# EAGLE design 11Dof MPU6000 (EAGLE 6.2)
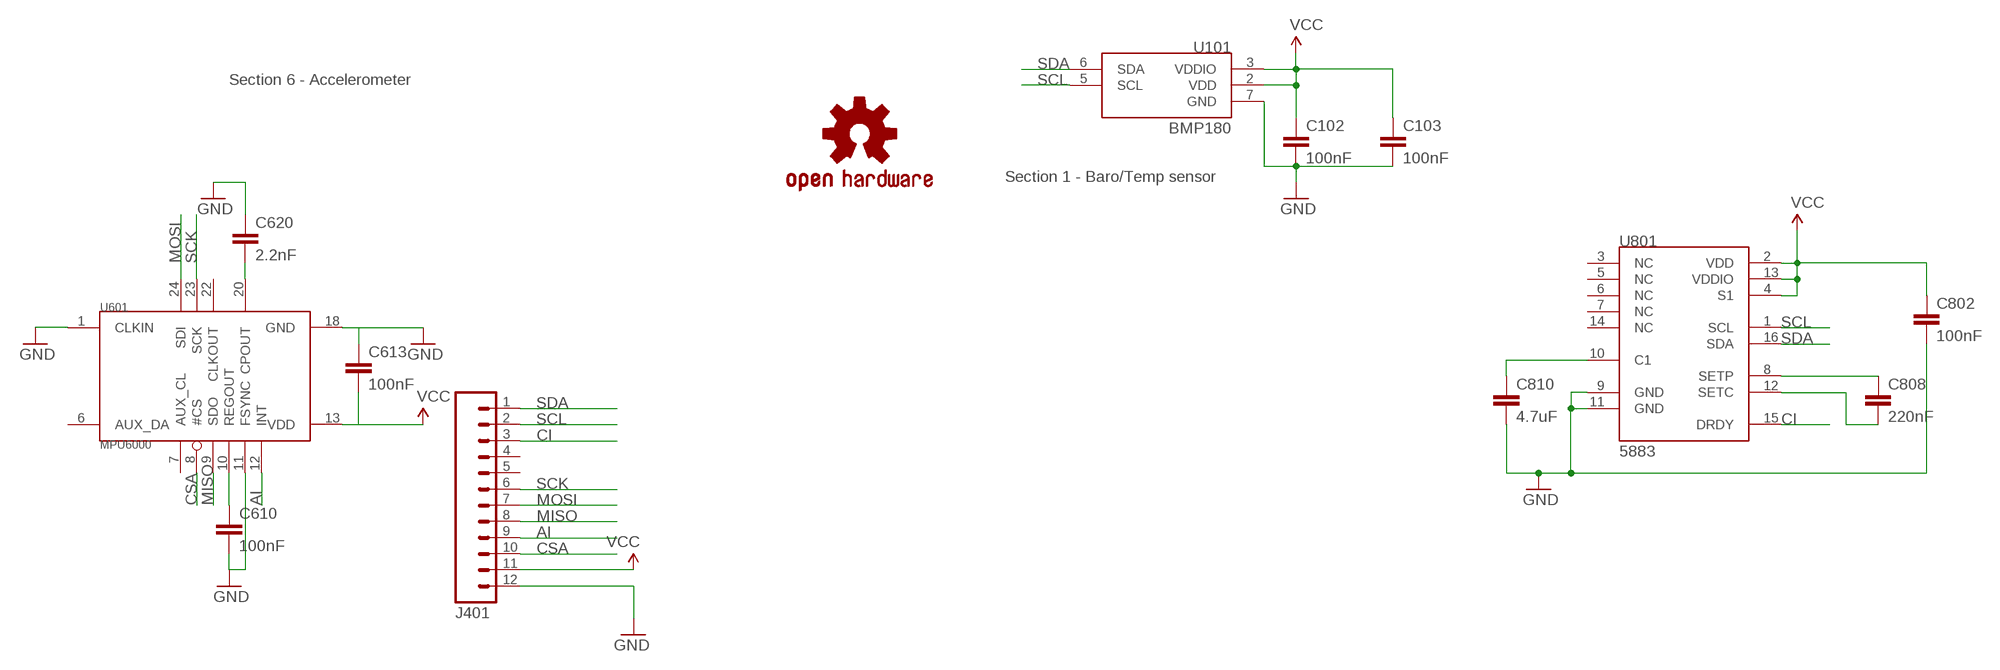
[diagram p0: schematic, sheet 1]

## Parts
C102  100nF  CAP0603-CAP  [0603-CAP]
C103  100nF  CAP0603-CAP  [0603-CAP]
C610  100nF  CAP0603-CAP  [0603-CAP]
C613  100nF  CAP0603-CAP  [0603-CAP]
C620  2.2nF  CAP0603-CAP  [0603-CAP]
C802  100nF  CAP0603-CAP  [0603-CAP]
C808  220nF  CAP0603-CAP  [0603-CAP]
C810  4.7uF  CAP0603-CAP  [0603-CAP]
J401  M12PTH  [1X12]
U101  BMP180  [BMP180]
U601  MPU6000  [MPU60X0]
U801  5883  HMC5883LSMD  [16LPCC]
U$2  OSHW-LOGOS  [OSHW-LOGO-S]

## Nets
AI: J401.9 U601.12(INT)
CI: J401.3 U801.15(DRDY)
CSA: J401.10 U601.8(#CS)
GND: C102.2 C103.2 C610.2 C613.1 C620.1 C802.2 C810.2 J401.12 U101.7(GND) U601.1(CLKIN) U601.11(FSYNC) U601.18(GND) U801.9(GND) U801.11(GND)
MISO: J401.8 U601.9(SDO)
MOSI: J401.7 U601.24(SDI)
N$1: C610.1 U601.10(REGOUT)
N$3: C620.2 U601.20(CPOUT)
N$14: C808.1 U801.8(SETP)
N$15: C808.2 U801.12(SETC)
N$16: C810.1 U801.10(C1)
SCK: J401.6 U601.23(SCK)
SCL: J401.2 U101.5(SCL) U801.1(SCL)
SDA: J401.1 U101.6(SDA) U801.16(SDA)
VCC [POWER]: C102.1 C103.1 C613.2 C802.1 J401.11 U101.2(VDD) U101.3(VDDIO) U601.13(VDD) U801.2(VDD) U801.4(S1) U801.13(VDDIO)
Unconnected: J401.4 J401.5 U601.6(AUX_DA) U601.7(AUX_CL) U601.22(CLKOUT) U801.3(NC) U801.5(NC) U801.6(NC) U801.7(NC) U801.14(NC)

## Notes on the sheet
- Section 6 - Accelerometer
- Section 1 - Baro/Temp sensor

## Library data of the parts
C102 C103 C610 C613 C802 = SparkFun:CAP: Capacitor Standard 0603 ceramic capacitor, and 0.1" leaded capacitor.; DIGIKEY: 445-1316-1-ND
C620 = SparkFun:CAP: Capacitor Standard 0603 ceramic capacitor, and 0.1" leaded capacitor.; DIGIKEY: 445-1311-1-ND
C808 = SparkFun:CAP: Capacitor Standard 0603 ceramic capacitor, and 0.1" leaded capacitor.; DIGIKEY: 445-5132-1-ND
C810 = SparkFun:CAP: Capacitor Standard 0603 ceramic capacitor, and 0.1" leaded capacitor.; DIGIKEY: 445-7483-1-ND
J401 = SparkFun:M12: Header 12 Standard 12-pin 0.1" header. Use with straight break away headers (SKU : PRT-00116), right angle break away headers (PRT-00553), swiss pins (PRT-00743), machine pins (PRT-00117), and female headers (PRT-00115).; DIGIKEY: $NOPART
U101 = KwanSystems:BMP180; DIGIKEY: 828-1027-1-ND
U601 = KwanSystems:MPU6000
U801 = SparkFun:HMC5883L: 3 Axis Digital Compass IC; DIGIKEY: 342-1082-1-ND
U$2 = SparkFun:OSHW-LOGO: Open Source Hardware Logo This logo indicates the piece of hardware it is found on incorporates a OSHW license and/or adheres to the definition of open source hardware found here: http://freedomdefined.org/OSHW; DIGIKEY: $NOPART

## Net classes
0 default: width 0.152 mm, drill 0.33 mm, clearance 0.152 mm
1 POWER: width 0.152 mm, drill 0.33 mm, clearance 0.152 mm
2 hv: width 0.152 mm, drill 0.33 mm, clearance 0.152 mm

## Board
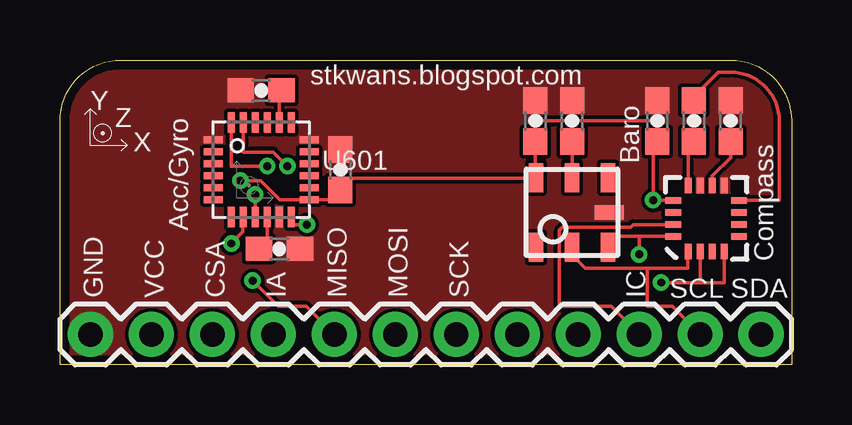
[diagram p1: board, top side]
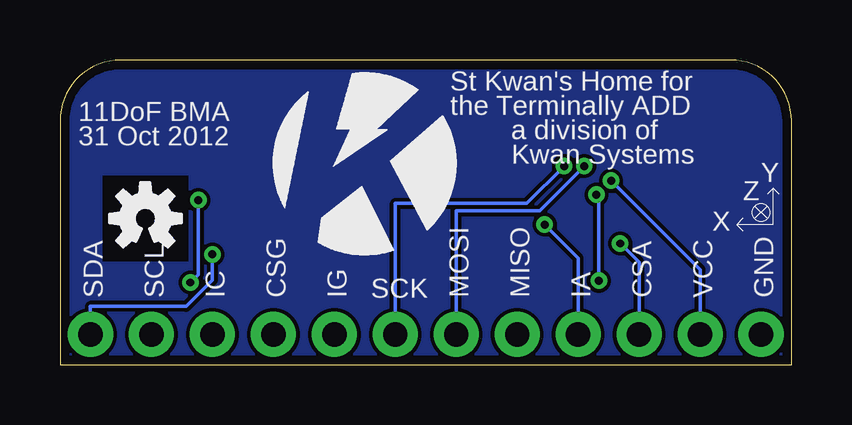
[diagram p2: board, bottom side, seen from below]

Size 30.48 x 12.7 mm. Coordinates in mm from the lower left corner, seen from the top.
Outline: 0,0 0,10.16 arc-90 2.54,12.7 27.94,12.7 arc-90 30.48,10.16 30.48,0 0,0
Copper layers (1*16): Top 0.0356mm / dielectric 1.5011mm / Bottom 0.0356mm
Design rules: minimum track width 6mil, minimum drill 13mil, track to track 6mil, track to pad 6mil, pad to pad 6mil, via to via 6mil, smd to smd 6mil, copper to edge 15mil, drill to drill 6mil, minimum pad ring 7mil, minimum via ring 7mil, stop-mask expansion 4mil, vias tented up to drill 14mil, thermal gap 10mil
tRestrict: area 25.1,7.1 to 25.9,7.9; area 27.9,7.1 to 28.7,7.9; area 27.9,4.3 to 28.7,5.1; area 25.1,4.3 to 25.9,5.1; area 25.9,5.1 to 27.9,7.1
bRestrict: area 25.1,4.3 to 28.7,7.9
vRestrict: area 0.8,2.8 to 1.8,4.8; area 3.3,2.8 to 4.3,4.8; area 5.8,2.8 to 6.9,4.8; area 8.4,2.8 to 9.4,3.8; area 10.9,2.8 to 11.7,5.3; area 12.7,2.8 to 15.2,3.6; area 13.5,3.6 to 14.2,5.3; area 15.5,2.8 to 18,3.6; area 18.5,2.8 to 19.6,3.8; area 20.6,2.8 to 22.6,3.6; area 21.1,3.6 to 21.8,4.8; area 23.6,2.8 to 24.4,3.8; 19 more areas

### Footprints (pad centres in the part's own frame; a part is rotated, then mirrored left to right if it is on the bottom)
0603-CAP = smd 1.1 x 1: 1 -0.85,0; 2 0.85,0
1X12 = drill 1.016 pad 1.88: 1 0,0; 2 2.54,0; 3 5.08,0; 4 7.62,0; 5 10.16,0; 6 12.7,0; 7 15.24,0; 8 17.78,0; 9 20.32,0; 10 22.86,0; 11 25.4,0; 12 27.94,0
BMP180 = smd 0.6 x 1.2: 1 1.5,1.45; 2 0,1.45; 3 -1.5,1.45; 4 -1.5,-1.45; 5 0,-1.45; 6 1.5,-1.45 | smd 1.2 x 0.6: 7 1.55,0
MPU60X0 = smd 0.8 x 0.3: 1 -2,1.25; 2 -2,0.75; 3 -2,0.25; 4 -2,-0.25; 5 -2,-0.75; 6 -2,-1.25; 13 2,-1.25; 14 2,-0.75; 15 2,-0.25; 16 2,0.25; 17 2,0.75; 18 2,1.25 | smd 0.3 x 0.85: 7 -1.25,-1.975; 8 -0.75,-1.975; 9 -0.25,-1.975; 10 0.25,-1.975; 11 0.75,-1.975; 12 1.25,-1.975; 19 1.25,1.975; 20 0.75,1.975; 21 0.25,1.975; 22 -0.25,1.975; 23 -0.75,1.975; 24 -1.25,1.975
16LPCC = smd 0.65 x 0.28: 1 -1.37,0.75; 2 -1.37,0.25; 3 -1.37,-0.25; 4 -1.37,-0.75; 9 1.37,-0.75; 10 1.37,-0.25; 11 1.37,0.25; 12 1.37,0.75 | smd 0.28 x 0.65: 5 -0.75,-1.37; 6 -0.25,-1.37; 7 0.25,-1.37; 8 0.75,-1.37; 13 0.75,1.37; 14 0.25,1.37; 15 -0.25,1.37; 16 -0.75,1.37

### Placement (x,y rotation side)
C102  21.34,10.16 90 top
C103  19.81,10.16 90 top
C610  9.14,4.83 0 top
C613  11.68,8.13 270 top
C620  8.38,11.43 0 top
C802  24.89,10.16 90 top
C808  26.42,10.16 270 top
C810  27.94,10.16 90 top
J401  29.21,1.27 180 top
U101  21.34,6.35 0 top
U601  8.38,8.13 0 top
U801  26.92,6.1 90 top
U$1  [KWAN_CIRCLE]  17.78,8.38 0 bottom
U$2  26.92,6.1 0 bottom

### Tracks (layer width: path | path; a pad name or v marks a point on that pad's centre or on a via)
AI  (via drill 0.33)
  Top 0.152: v10.29,5.84 9.63,5.84 U601.12
  Bottom 0.152: v10.29,5.84 8.89,4.45 J401.9
CI
  Top 0.152: U801.15 23.88,5.84 23.77,5.74 20.93,5.74 20.8,5.61 20.8,2.44 22.96,2.44 J401.3
CSA  (via drill 0.33)
  Top 0.152: v7.14,5.05 7.62,5.54 U601.8
  Bottom 0.152: v7.14,5.05 6.35,4.27 J401.10
GND
  pour Top (no thermals): 2.54,12.7 27.94,12.7 arc-90 30.48,10.16 30.48,0 0,0 0,10.16 arc-90
MISO  (via drill 0.33)
  Top 0.152: v8.13,7.09 8.13,6.17 U601.9 | v8.03,3.5 9.09,2.44 10.26,2.44 J401.8
  Bottom 0.152: v8.13,7.09 8.03,6.99 v8.03,3.5
MOSI  (via drill 0.33)
  Top 0.152: v8.64,8.28 7.14,8.28 7.14,10.08 U601.24
  Bottom 0.152: v8.64,8.28 10.49,6.43 13.97,6.43 J401.7
N$1
  Top 0.152: U601.10 8.63,5.16 C610.1
N$2
  pour Bottom (no thermals): 2.54,12.7 27.94,12.7 arc-90 30.48,10.16 30.48,0 0,0 0,10.16 arc-90
N$3
  Top 0.152: U601.20 9.13,11.33 C620.2
N$14
  Top 0.152: C808.1 26.42,11.18 27.43,12.19 27.94,12.19 arc-90 29.97,10.16 29.97,6.85 U801.8
N$15
  Top 0.152: U801.12 26.17,9.07 C808.2
N$16
  Top 0.152: U801.10 27.17,7.87 27.94,8.64 C810.1
SCK  (via drill 0.33)
  Top 0.152: v9.47,8.28 8.89,8.87 7.64,8.87 7.64,10.08 U601.23
  Bottom 0.152: v9.47,8.28 11.02,6.73 16.51,6.73 J401.6
SCL
  Top 0.152: 24.46,4.01 26.16,4.01 U801.1 | 24.46,4.01 24.46,2.44 25.5,2.44 J401.2 | 24.46,4.01 21.89,4.01 21.34,4.57 U101.5
SDA  (via drill 0.33)
  Top 0.152: 24.13,5.35 22.84,5.35 U101.6 | 24.13,5.35 U801.16 | 24.13,5.35 v24.13,4.6
  Bottom 0.152: v24.13,4.6 24.13,3.53 25.22,2.44 29.21,2.44 J401.1
VCC  (via drill 0.33)
  Top 0.152: 21.34,10.16 19.81,10.16 C103.1 19.81,7.82 U101.3 19.76,7.77 12.19,7.77 11.73,7.32 C613.2 11.68,6.88 U601.13 9.15,6.88 8.36,7.67 v7.52,7.67 | 21.34,10.16 24.89,10.16 C802.1 24.71,9.13 v24.71,6.86 U801.13 | U101.2 C102.1 21.34,10.16 | v25.04,3.43 26.67,3.43 | 26.67,3.43 27.67,3.43 U801.4 | U801.2 26.67,3.43
  Bottom 0.152: v25.04,3.43 24.71,3.76 v24.71,6.86 | v7.52,7.67 3.81,3.96 J401.11

### Text on the board
tPlace: stkwans.blogspot.com | Y | Z | X | Baro | Acc/Gyro | Compass | GND | VCC | CSA | IA | MISO | MOSI | SCK | IC | SCL | SDA
bPlace: St Kwan's Home for | the Terminally ADD | 11DoF BMA | a division of | 31 Oct 2012 | Y | Kwan Systems | Z | X | GND | VCC | CSA | IA | MISO | MOSI | SCK | IG | CSG | IC | SCL | SDA